# Altium project Beagle93.PrjPCB (part 4 of 5)

## Sheet dac.SchDoc
size A4
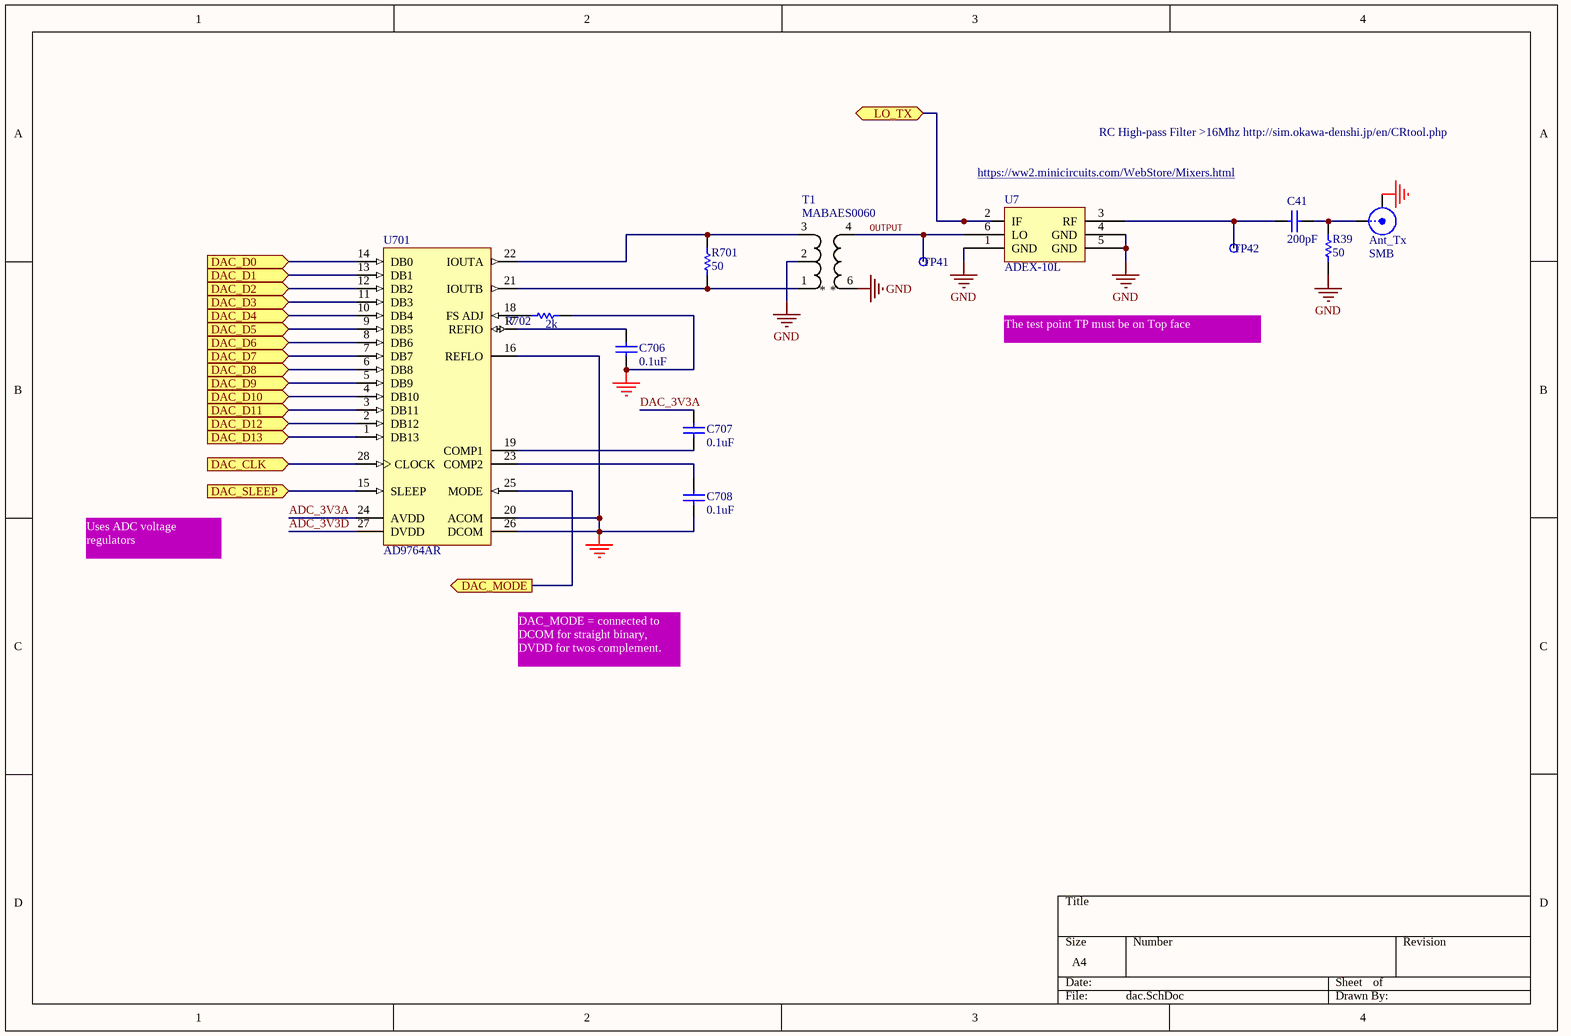
[diagram p6: dac.SchDoc]

### Parts
(Parts that share a designator on the sheet are numbered #1, #2 ... from top to bottom, then left to right.)
Ant_Tx  SMB  [SMB_V-RJ45]
C41  value 200pF  [0402]  (hidden comment: Cap Semi)
C706  0.1uF  [CAPC1005X55N]
C707  0.1uF  [CAPC1005X55N]
C708  0.1uF  [CAPC1005X55N]
R39  value 50  [0402]  (hidden comment: Res Semi)
R701  50  [RESC1005N]
R702  2k  [RESC1005N]
T1  MABAES0060  [MABAES0060]
TP41  LO_RX  [TPS127]  (value not drawn)
TP42#2  LO_RX  [TPS127]  (value not drawn)
U7  ADEX-10L
U701  AD9764AR  [TSSOP-28]

### Ports
DAC_CLK (in), DAC_D0 (in), DAC_D1 (in), DAC_D2 (in), DAC_D3 (in), DAC_D4 (in), DAC_D5 (in), DAC_D6 (in), DAC_D7 (in), DAC_D8 (in), DAC_D9 (in), DAC_D10 (in), DAC_D11 (in), DAC_D12 (in), DAC_D13 (in), DAC_MODE (out), DAC_SLEEP (in), LO_TX

### Nets
GND: Ant_Tx.2(Y) C706.1 C708.1 R39.1 R702.2 T1.2 T1.6 U7.1(GND) U7.4(GND) U7.5(GND) U701.16(REFLO) U701.20(ACOM) U701.26(DCOM)  [project net DXN_0]
ADC_3V3A: U701.24(AVDD)
ADC_3V3D: U701.27(DVDD)
DAC_3V3A: C707.1
DAC_CLK: U701.28(CLOCK) ; port DAC_CLK
DAC_D0: U701.14(DB0) ; port DAC_D0
DAC_D1: U701.13(DB1) ; port DAC_D1
DAC_D2: U701.12(DB2) ; port DAC_D2
DAC_D3: U701.11(DB3) ; port DAC_D3
DAC_D4: U701.10(DB4) ; port DAC_D4
DAC_D5: U701.9(DB5) ; port DAC_D5
DAC_D6: U701.8(DB6) ; port DAC_D6
DAC_D7: U701.7(DB7) ; port DAC_D7
DAC_D8: U701.6(DB8) ; port DAC_D8
DAC_D9: U701.5(DB9) ; port DAC_D9
DAC_D10: U701.4(DB10) ; port DAC_D10
DAC_D11: U701.3(DB11) ; port DAC_D11
DAC_D12: U701.2(DB12) ; port DAC_D12
DAC_D13: U701.1(DB13) ; port DAC_D13
DAC_SLEEP: U701.15(SLEEP) ; port DAC_SLEEP
OUTPUT: T1.4 TP41.1 U7.6(LO)
NetAnt_Tx_1: Ant_Tx.1(X) C41.2 R39.2
NetC41_1: C41.1 TP42#2.1 U7.3(RF)
NetC706_2: C706.2 U701.17(REFIO)
NetC707_2: C707.2 U701.19(COMP1)
NetC708_2: C708.2 U701.23(COMP2)
NetR701_1: R701.1 T1.3 U701.22(IOUTA)
NetR701_2: R701.2 T1.1 U701.21(IOUTB)
NetR702_1: R702.1 U701.18(FS_ADJ)
NetU7_2: U7.2(IF) ; port LO_TX
NetU701_25: U701.25(MODE) ; port DAC_MODE

### Notes on the sheet
- https://ww2.minicircuits.com/WebStore/Mixers.html
- RC High-pass Filter >16Mhz http://sim.okawa-denshi.jp/en/CRtool.php
- The test point TP must be on Top face
- Uses ADC voltage regulators
- DAC_MODE = connected to DCOM for straight binary, DVDD for twos complement.

### Library data of the parts
Ant_Tx = SMB: SMB Straight Connector; LatestRevisionDate: 17-Jul-2002; LatestRevisionNote: Re-released for DXP Platform.; Publisher: Altium Limited
C41 = Cap Semi: Capacitor (Semiconductor SIM Model); Published: 8-Jun-2000; LatestRevisionDate: 29-May-2009; LatestRevisionNote: IPC-7351 Footprint Added.; PackageReference: C1206; Publisher: Altium Limited; PackageDescription: Chip Capacitor
C706-C708 = Cap: as C1 on sheet adc; Published: 8-Jun-2000; Revision: July-2002: Re-released for DXP Platform.; Publisher: Altium Limited; Value: 0.1uF; Distributor: Digikey; Distributor Part Number: PCC1843CT-ND
R39 = Res Semi: Semiconductor Resistor; Published: 8-Jun-2000; LatestRevisionDate: 17-Jul-2002; LatestRevisionNote: Re-released for DXP Platform.; PackageReference: AXIAL-0.5; Publisher: Altium Limited; PackageDescription: Axial Device, Thru-Hole; 2 Leads; 0.5 in Pin Spacing
R701 = Res1: Resistor; Manufacturer: Generic Components; Class I: Passive; Value: 1K; Published: 8-Jun-2000; Revision: July-2002: Re-released for DXP Platform.; Publisher: Altium Limited; Class II: Resistor
R702 = Res1: Resistor; Manufacturer: Generic Components; Class I: Passive; Published: 8-Jun-2000; Revision: July-2002: Re-released for DXP Platform.; Publisher: Altium Limited; Class II: Resistor; Value: 2K
T1 = Balun: Manufacturer: Mini-Circuits; Part Description: RF balun 0.3-200Mhz; Manufacturer Part Number 1: MABAES0060; Supplier Part Number 1: 1465-1317-1-ND; Supplier 1: digikey
TP41 TP42#2 = SMD_PAD_1.27X1.27MM: as DFS on sheet adc; Part Number: SMD_PAD_1.27X1.27MM; Component Kind: Standard (No BOM); Component Type: Standard (No BOM); Pin Count: 1; Family: Test Point; Socket: No; SMD: Yes; Sense: No; Status: None; ComponentHeight: 0mm; HelpURL: Undefined; Author: CERN DEM JLC; CreateDate: 12.01.2008; LatestRevisionDate: 12.01.2008; PackageDescription: 1.27mm x 1.27mm PCB Copper Area (SMD Test Point)
U7 = ADEX-10L: Passive Mixer
U701 = AD9764AR: Single 14-Bit TxDAC, 125 Msps, -40 to +85 degC, RW-28, Tube; ADI Part Number: AD9764; Manufacturer: Analog Devices; # DAC Outputs: 1; Max V+: 5.5V; Op Pwr Diss: 170mW; Resolution (Bits): 14; Settling Time: 35ns; Single Supply: Yes; DatasheetVersion: Rev.B; PackageVersion: 060706-A; PackageReference: RW-28; PackageDescription: 28-Lead Standard Small Outline Package [SOIC_W]; Packing: Tube; RoHS: N; Mounting Technology: Surface Mount; Code_JEDEC: MS-013-AE; ComponentLink1Description: Manufacturer URL; ComponentLink1URL: http://www.analog.com/en/index.html; ComponentLink2Description: Datasheet; ComponentLink2URL: http://www.analog.com/static/imported-files/data_sheets/AD9764.pdf; ComponentLink3Description: URL Link1; ComponentLink3URL: Product URL:http://www.analog.com/en/digital-to-analog-converters/da-converters/ad9764/products/product.html

## Sheet avr.SchDoc
size A2
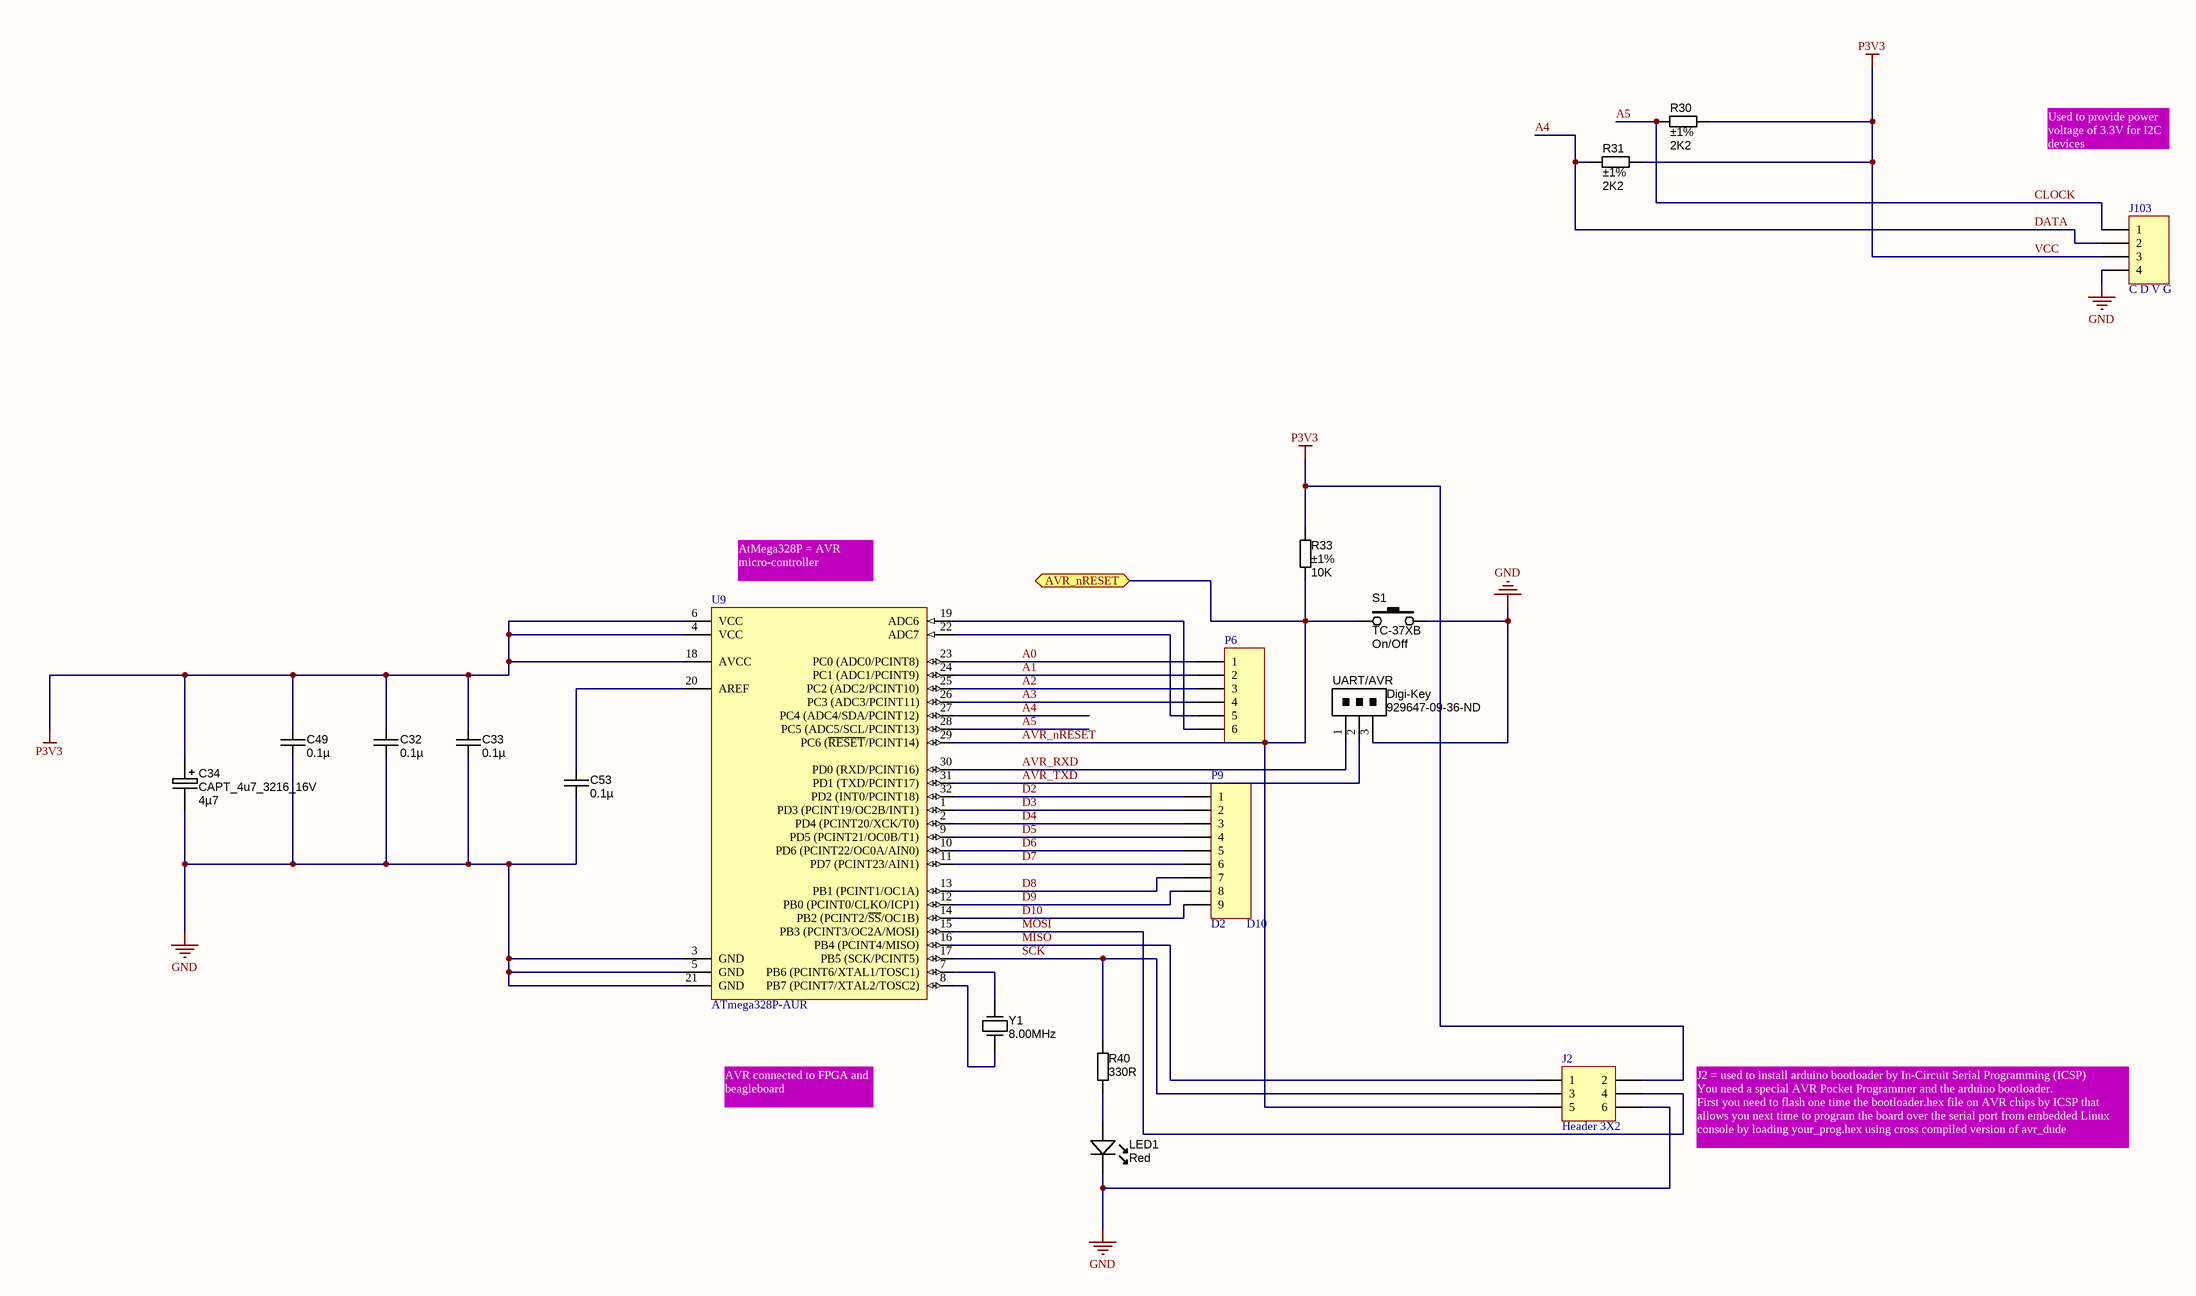
[diagram p7: avr.SchDoc]

### Parts
C32  0.1µ  [CAPC1005X55N]
C33  0.1µ  [CAPC1005X55N]
C34  CAPT_4u7_3216_16V  value 4µ7  [CAPMP3216X180N]
C49  0.1µ  [CAPC1005X55N]
C53  0.1µ  [CAPC1005X55N]
J2  Header 3X2  [HDR2X3]
J103  C D V G  [HDR1X4]
LED1  Color: Red  [LED-0603-RED]
P6  (no value)  [HDR1X6]
P9  D2       D10  [HDR1X9]
R30  value 2K2  Tolerance: ±1%  [RESC1005N]  (hidden comment: Thick Film)
R31  value 2K2  Tolerance: ±1%  [RESC1005N]  (hidden comment: Thick Film)
R33  value 10K  Tolerance: ±1%  [RESC1005X40N]  (hidden comment: Thick Film)
R40  value 330R  [RESC1005X40N]  (hidden comment: Thick Film)
S1  Manufacturer Part Number 1: TC-37XB  Function: On/Off  [TACT-SWITCH-TS1143]  (hidden comment: SW_THT_PB_5.0mm)
U9  ATmega328P-AUR  [32A_N]
UART/AVR  Supplier 1: Digi-Key  Supplier Part Number 1: 929647-09-36-ND  [1x3POS_HEADER]  (hidden comment: R T G)
Y1  8.00MHz  [CRYSTAL_HC49-US-SM]

### Ports
AVR_nRESET (bidir)

### Nets
GND: C32.2 C33.2 C34.2 C49.2 C53.2 J2.6 J103.4 LED1.K S1.2 U9.3(GND) U9.5(GND) U9.21(GND) UART/AVR.3  [project net DXN_0]
VCC: C32.1 C33.1 C34.1 C49.1 J2.2 J103.3 R30.2 R31.2 R33.1 U9.4(VCC) U9.6(VCC) U9.18(AVCC)  [also labelled P3V3]
A0: P6.1 U9.23(PC0_(ADC0/PCINT8))
A1: P6.2 U9.24(PC1_(ADC1/PCINT9))
A2: P6.3 U9.25(PC2_(ADC2/PCINT10))
A3: P6.4 U9.26(PC3_(ADC3/PCINT11))
A4: J103.2 R31.1 U9.27(PC4_(ADC4/SDA/PCINT12))  [also labelled DATA]
A5: J103.1 R30.1 U9.28(PC5_(ADC5/SCL/PCINT13))  [also labelled CLOCK]
AVR_nRESET: J2.5 R33.2 S1.1 U9.29(PC6_(~{RESET}/PCINT14)) ; port AVR_nRESET
AVR_RXD: U9.30(PD0_(RXD/PCINT16)) UART/AVR.1
AVR_TXD: U9.31(PD1_(TXD/PCINT17)) UART/AVR.2
D2: P9.1 U9.32(PD2_(INT0/PCINT18))
D3: P9.2 U9.1(PD3_(PCINT19/OC2B/INT1))
D4: P9.3 U9.2(PD4_(PCINT20/XCK/T0))
D5: P9.4 U9.9(PD5_(PCINT21/OC0B/T1))
D6: P9.5 U9.10(PD6_(PCINT22/OC0A/AIN0))
D7: P9.6 U9.11(PD7_(PCINT23/AIN1))
D8: P9.7 U9.13(PB1_(PCINT1/OC1A))
D9: P9.8 U9.12(PB0_(PCINT0/CLKO/ICP1))
D10: P9.9 U9.14(PB2_(PCINT2/~{SS}/OC1B))
MISO: J2.1 U9.16(PB4_(PCINT4/MISO))
MOSI: J2.4 U9.15(PB3_(PCINT3/OC2A/MOSI))
SCK: J2.3 R40.1 U9.17(PB5_(SCK/PCINT5))
NetC53_1: C53.1 U9.20(AREF)
NetLED1_A: LED1.A R40.2
NetP6_5: P6.5 U9.22(ADC7)
NetP6_6: P6.6 U9.19(ADC6)
NetU9_7: U9.7(PB6_(PCINT6/XTAL1/TOSC1)) Y1.2(OUT)
NetU9_8: U9.8(PB7_(PCINT7/XTAL2/TOSC2)) Y1.1(IN)

### Notes on the sheet
- Used to provide power voltage of 3.3V for I2C devices
- (near U9) AtMega328P = AVR micro-controller
- AVR connected to FPGA and beagleboard
- J2 = used to install arduino bootloader by In-Circuit Serial Programming (ICSP)
  You need a special AVR Pocket Programmer and the arduino bootloader.
  First you need to flash one time the bootloader.hex file on AVR chips by ICSP that
  allows you next time to program the board over the serial port from embedded Linux
  console by loading your_prog.hex using cross compiled version of avr_dude

### Library data of the parts
C32 C33 C49 C53 = CAPC_1u_0402_X5R_6V3_10%: Capacitor SMD Cer 1uF 10% 16V X5R 0402; Manufacturer 1: AVX Corporation; Manufacturer Part Number 1: 04026D105KAT2A; Ratings: 6.3V; X5R; SCDType: spec; Value: 0.1µ; Tolerance: ±10%; Operating Temperature: -55°C ~ 125°C; Package / Case: 0402 (1005 Metric); Size / Dimension: 0.039" L x 0.020" W (1.00mm x 0.50mm); Supplier 1: Digi-Key; Supplier Part Number 1: 478-2583-1-ND; RoHS 1: RoHS Compliant; ComponentLink1URL: http://www.avx.com/docs/Catalogs/cx5r.pdf; ComponentLink1Description: http://www.avx.com/docs/Catalogs/cx5r.pdf; Supplier 2: Digi-Key; Supplier Part Number 2: 311-1438-1-ND; Manufacturer 2: Yageo; Manufacturer Part Number 2: CC0402KRX5R5BB105; RoHS 2: RoHS Compliant; ComponentLink2URL: http://www.yageo.com/documents/recent/UPY-GPHC_X5R_4V-to-50V_12.pdf; ComponentLink2Description: http://www.yageo.com/documents/recent/UPY-GPHC_X5R_4V-to-50V_12.pdf; Supplier 3: Digi-Key; Supplier Part Number 3: 1276-1010-1-ND; Manufacturer 3: Samsung Electro-Mechanics America, Inc; Manufacturer Part Number 3: CL05A105KQ5NNNC; RoHS 3: RoHS Compliant; ComponentLink3URL: http://www.samsungsem.com/servlet/FileDownload?path=productsearch&sname=CL05A105KQ5NNNC.pdf&oname=CL05A105KQ5NNNC.pdf; ComponentLink3Description: http://www.samsungsem.com/servlet/FileDownload?path=productsearch&sname=CL05A105KQ5NNNC.pdf&oname=CL05A105KQ5NNNC.pdf; Supplier 4: Digi-Key; Supplier Part Number 4: 445-4998-1-ND; Manufacturer 4: TDK Corporation; Manufacturer Part Number 4: C1005X5R0J105K050BB; RoHS 4: RoHS Compliant; ComponentLink4URL: http://product.tdk.com/capacitor/mlcc/en/documents/mlcc_commercial_general_en.pdf; ComponentLink4Description: http://product.tdk.com/capacitor/mlcc/en/documents/mlcc_commercial_general_en.pdf; Supplier 5: Digi-Key; Supplier Part Number 5: 490-1320-1-ND; Manufacturer 5: Murata Electronics North America; Manufacturer Part Number 5: GRM155R60J105KE19D; RoHS 5: RoHS Compliant; ComponentLink5URL: http://www.murata.com/products/catalog/pdf/c02e.pdf; ComponentLink5Description: http://www.murata.com/products/catalog/pdf/c02e.pdf
C34 = CAPT_4u7_3216_16V: Capacitor SMD Tantalum 4.7uF 10% 16V 3216-18; Manufacturer 1: Vishay/Sprague; Manufacturer Part Number 1: 293D475X9016A2TE3; SCDType: undef; Package / Case: EIA 535BAAC size A; Ratings: 16V; Tolerance: ±10%; Material: Tantalum; Supplier 1: Digi-Key; Supplier Part Number 1: 718-1148-1-ND
J2 = Header 3X2: Header, 3-Pin, Dual row; LatestRevisionDate: 17-Jul-2002; LatestRevisionNote: Re-released for DXP Platform.; Publisher: Altium Limited
J103 = Header 4: Header, 4-Pin; LatestRevisionDate: 17-Jul-2002; LatestRevisionNote: Re-released for DXP Platform.; Publisher: Altium Limited
LED1 = LED_SMD_Red_0805_6mcd: LED 0805 SMD Red 6mcd 621nm; Manufacturer 1: Lite-On Inc; Manufacturer Part Number 1: LTST-C171EKT; Material: GaAsP on GaP; Ratings: 6 mcd; 621 nm; SCDType: source; Package / Case: 0805; Supplier 1: Digi-Key; Supplier Part Number 1: 160-1422-1-ND; Value: Red
P6 = Header 6: Header, 6-Pin; LatestRevisionDate: 17-Jul-2002; LatestRevisionNote: Re-released for DXP Platform.; Publisher: Altium Limited
P9 = Header 9: Header, 9-Pin; LatestRevisionDate: 17-Jul-2002; LatestRevisionNote: Re-released for DXP Platform.; Publisher: Altium Limited
R30 R31 = RES_2K2_0805_1%: Resistor SMD chip 2.2k Ohm 0.125W 1% 0805; Manufacturer 1: Vishay/Dale; Manufacturer Part Number 1: CRCW08052K20FKEA; Ratings: 1/8W; SCDType: spec; Supplier 1: Digi-Key; Supplier Part Number 1: 541-2.20KCCT-ND; Package / Case: 0805 (2012 metric)
R33 = RES_10K_0402_1%: Resistor SMD chip 10k Ohm 0.063W 1% 0402; Manufacturer 1: Vishay Dale; Manufacturer Part Number 1: CRCW040210K0FKED; Ratings: 1/16 W; SCDType: spec; Package / Case: 0402 (1005 Metric); Manufacturer 2: Yageo; Manufacturer Part Number 2: RC0402FR-0710KL; Supplier 1: Digi-Key; Supplier Part Number 1: 541-10.0KLCT-ND; ComponentLink1URL: http://www.vishay.com/doc?20035; ComponentLink1Description: http://www.vishay.com/doc?20035; Supplier 2: Digi-Key; Supplier Part Number 2: 311-10.0KLRCT-ND; ComponentLink2URL: http://www.yageo.com/documents/recent/PYu-RC0402_51_RoHS_L_6.pdf; ComponentLink2Description: http://www.yageo.com/documents/recent/PYu-RC0402_51_RoHS_L_6.pdf
R40 = RES_330R_0402_5%: Resistor SMD chip 330 Ohm 0.063W 5% 0402; Manufacturer 1: Yageo; Manufacturer Part Number 1: RC0402JR-07330RL; Ratings: 1/16 W; SCDType: spec; Package / Case: 0402 (1005 Metric); Tolerance: ±5%; Supplier 1: Digi-Key; Supplier Part Number 1: 311-330JRCT-ND; ComponentLink1URL: http://www.yageo.com/documents/recent/PYu-RC0402_51_RoHS_L_6.pdf; ComponentLink1Description: http://www.yageo.com/documents/recent/PYu-RC0402_51_RoHS_L_6.pdf
S1 = SW_THT_PB_5.0mm: Switch, tact, 5.0mm stem; Manufacturer 1: Wealth Metal; SCDType: spec; Package / Case: 6.5x6.5mm; 5.0mm stem; Material: Brass/Nylon/Ag plating
U9 = ATmega328-AUR: 8-bit AVR Microcontroller, 32KB Flash, 1KB EEPROM, 2KB SRAM, 32-pin TQFP, Industrial Grade (-40°C to 85°C); Published: 1-Apr-2010; DatasheetVersion: revA, Jan-2010; PackageVersion: revB, Oct-2001; PackageReference: 32A; Publisher: Altium Limited; PackageDescription: 32-Lead, 7x7x1.0 mm Body, 0.8mm Lead Pitch, Thin Profile Plastic Quad Flat Package (TQFP); Supplier 1: Digi-Key; Supplier Part Number 1: ATMEGA328P-AUR-ND; Supplier 2: Mouser; Supplier Part Number 2: 556-ATMEGA328P-AUR; Code_JEDEC: MS-026-ABA; ComponentLink1Description: Manufacturer Link; ComponentLink1URL: http://www.atmel.com/products/avr/default.asp?; ComponentLink2Description: ATmega48A/48PA/88A/88PA/168A/168PA/328/328P Datasheet; ComponentLink2URL: http://www.atmel.com/dyn/resources/prod_documents/8271.pdf; ComponentLink3Description: ATmega48A/48PA/88A/88PA/168A/168PA/328/328P Summary; ComponentLink3URL: http://www.atmel.com/dyn/resources/prod_documents/8271S.pdf; ComponentLink4Description: Atmel.com Home; ComponentLink4URL: http://www.atmel.com
UART/AVR = CONN_HEADER_1x3P_0.100in: Pin Header, THT, Single-row, 2.54mm pitch; Manufacturer 1: 3M; Manufacturer Part Number 1: 929647-09-36-I; Pitch: 0.100" (2.54mm); Value: Single-row, 3 positions; QtyOverride: 0.1; SCDType: undef; Category: Connectors; Mounting Type: Through Hole; Terminal Block Type: Header, Male Pins, Single; Package / Case: Pin header; 2.54mm pitch
Y1 = Crystal_6MHz_HC49/US: Resonator Ceramic 8.00 MHz 30ppm; Manufacturer 1: CTS-Frequency Controls; Manufacturer Part Number 1: ATS080BSM-1; Frequency: 8MHz; Frequency Stability: ±50ppm; Load Capacitance: 18pF; Operating Mode: Fundamental; Parameter Name: 0.169" (4.30mm); Package / Case: HC49/US-SM; Ratings: 8.00 MHz; Supplier 1: Digi-Key; Type: 8 MHz Crystal; Frequency Tolerance: ±30ppm; Operating Temperature: -20°C ~ 70°C; Mounting Type: Surface Mount; Size / Dimension: 0.437" L x 0.190" W (11.10mm x 4.83mm); ComponentLink1URL: http://www.ctscorp.com/components/Datasheets/008-0309-0.pdf; ComponentLink1Description: http://www.ctscorp.com/components/Datasheets/008-0309-0.pdf

## Sheet main.schdoc
size A2; Organization: Protel International P/L; Address1: L3, 12a Rodborough Rd; Address2: Frenchs Forest; Address3: NSW; Address4: Australia 2086
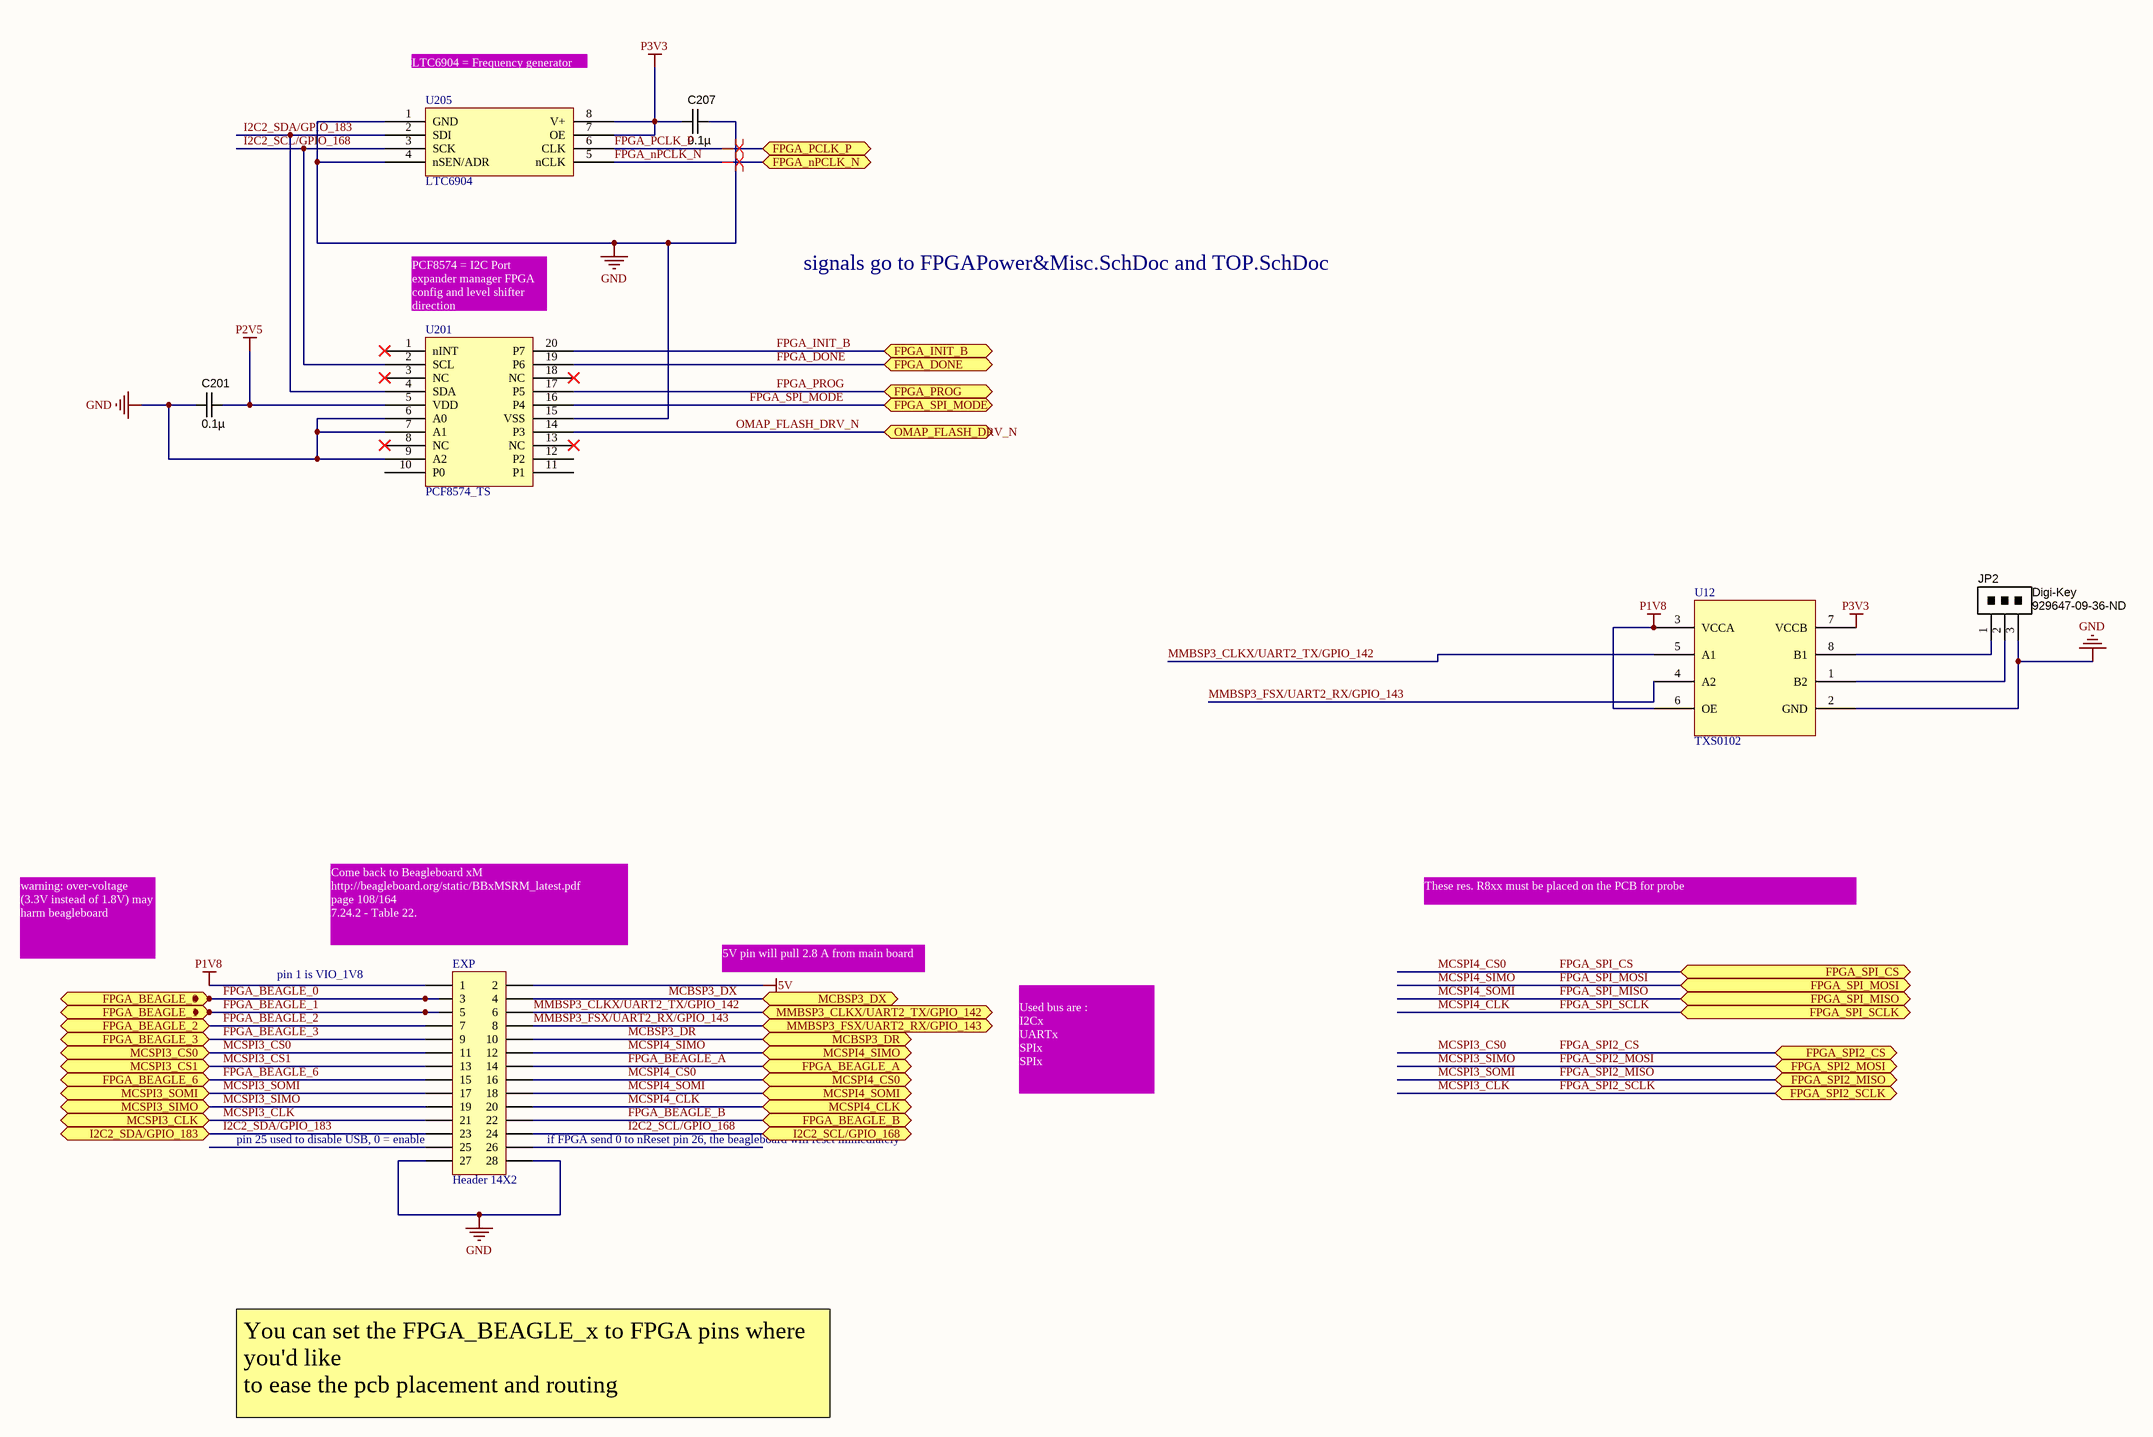
[diagram p8: main.schdoc]

### Parts
C201  0.1µ  [CAPC1005X55N]
C207  0.1µ  [CAPC1005X55N]
EXP  Header 14X2  [HDR2X14]
JP2  Supplier 1: Digi-Key  Supplier Part Number 1: 929647-09-36-ND  [1x3POS_HEADER]  (hidden comment: R T G)
U12  TXS0102  [TSSOP65P400X110-8N]
U201  PCF8574_TS  [TSSOP65P640X120-20N]
U205  LTC6904  [SOP65P490X109-8N]

### Ports
FPGA_BEAGLE_0 (bidir), FPGA_BEAGLE_1 (bidir), FPGA_BEAGLE_2 (bidir), FPGA_BEAGLE_3 (bidir), FPGA_BEAGLE_6 (bidir), FPGA_BEAGLE_A (bidir), FPGA_BEAGLE_B (bidir), FPGA_DONE (bidir), FPGA_INIT_B (bidir), FPGA_nPCLK_N (bidir), FPGA_PCLK_P (bidir), FPGA_PROG (bidir), FPGA_SPI2_CS (bidir), FPGA_SPI2_MISO (bidir), FPGA_SPI2_MOSI (bidir), FPGA_SPI2_SCLK (bidir), FPGA_SPI_CS (bidir), FPGA_SPI_MISO (bidir), FPGA_SPI_MODE (bidir), FPGA_SPI_MOSI (bidir), FPGA_SPI_SCLK (bidir), I2C2_SCL/GPIO_168 (bidir), I2C2_SDA/GPIO_183 (bidir), MCBSP3_DR (bidir), MCBSP3_DX (bidir), MCSPI3_CLK (bidir), MCSPI3_CS0 (bidir), MCSPI3_CS1 (bidir), MCSPI3_SIMO (bidir), MCSPI3_SOMI (bidir), MCSPI4_CLK (bidir), MCSPI4_CS0 (bidir), MCSPI4_SIMO (bidir), MCSPI4_SOMI (bidir), MMBSP3_CLKX/UART2_TX/GPIO_142 (bidir), MMBSP3_FSX/UART2_RX/GPIO_143 (bidir), OMAP_FLASH_DRV_N (bidir)

### Nets
5V: EXP.2
GND: C201.2 C207.1 EXP.27 EXP.28 JP2.3 U12.2(GND) U201.6(A0) U201.7(A1) U201.9(A2) U201.15(VSS) U205.1(GND) U205.4(nSEN/ADR)  [project net DXN_0]
P1V8: EXP.1 U12.3(VCCA) U12.6(OE)
P2V5: C201.1 U201.5(VDD)
P3V3: C207.2 U12.7(VCCB) U205.7(OE) U205.8(V+)  [project net VCC]
FPGA_BEAGLE_0: EXP.3 ; port FPGA_BEAGLE_0
FPGA_BEAGLE_1: EXP.5 ; port FPGA_BEAGLE_1
FPGA_BEAGLE_2: EXP.7 ; port FPGA_BEAGLE_2
FPGA_BEAGLE_3: EXP.9 ; port FPGA_BEAGLE_3
FPGA_BEAGLE_6: EXP.15 ; port FPGA_BEAGLE_6
FPGA_BEAGLE_A: EXP.14 ; port FPGA_BEAGLE_A
FPGA_BEAGLE_B: EXP.22 ; port FPGA_BEAGLE_B
FPGA_DONE: U201.19(P6) ; port FPGA_DONE
FPGA_INIT_B: U201.20(P7) ; port FPGA_INIT_B
FPGA_nPCLK_N: U205.5(nCLK) ; port FPGA_nPCLK_N
FPGA_PCLK_P: U205.6(CLK) ; port FPGA_PCLK_P
FPGA_PROG: U201.17(P5) ; port FPGA_PROG
FPGA_SPI2_CS: EXP.11 ; port MCSPI3_CS0, port FPGA_SPI2_CS  [also labelled MCSPI3_CS0]
FPGA_SPI2_MISO: EXP.17 ; port MCSPI3_SOMI, port FPGA_SPI2_MISO  [also labelled MCSPI3_SOMI]
FPGA_SPI2_MOSI: EXP.19 ; port MCSPI3_SIMO, port FPGA_SPI2_MOSI  [also labelled MCSPI3_SIMO]
FPGA_SPI2_SCLK: EXP.21 ; port MCSPI3_CLK, port FPGA_SPI2_SCLK  [also labelled MCSPI3_CLK]
FPGA_SPI_CS: EXP.16 ; port MCSPI4_CS0, port FPGA_SPI_CS  [also labelled MCSPI4_CS0]
FPGA_SPI_MISO: EXP.18 ; port MCSPI4_SOMI, port FPGA_SPI_MISO  [also labelled MCSPI4_SOMI]
FPGA_SPI_MODE: U201.16(P4) ; port FPGA_SPI_MODE
FPGA_SPI_MOSI: EXP.12 ; port MCSPI4_SIMO, port FPGA_SPI_MOSI  [also labelled MCSPI4_SIMO]
FPGA_SPI_SCLK: EXP.20 ; port MCSPI4_CLK, port FPGA_SPI_SCLK  [also labelled MCSPI4_CLK]
I2C2_SCL/GPIO_168: EXP.24 U201.2(SCL) U205.3(SCK) ; port I2C2_SCL/GPIO_168
I2C2_SDA/GPIO_183: EXP.23 U201.4(SDA) U205.2(SDI) ; port I2C2_SDA/GPIO_183
MCBSP3_DR: EXP.10 ; port MCBSP3_DR
MCBSP3_DX: EXP.4 ; port MCBSP3_DX
MCSPI3_CS1: EXP.13 ; port MCSPI3_CS1
MMBSP3_CLKX/UART2_TX/GPIO_142: EXP.6 U12.5(A1) ; port MMBSP3_CLKX/UART2_TX/GPIO_142
MMBSP3_FSX/UART2_RX/GPIO_143: EXP.8 U12.4(A2) ; port MMBSP3_FSX/UART2_RX/GPIO_143
OMAP_FLASH_DRV_N: U201.14(P3) ; port OMAP_FLASH_DRV_N
NetJP2_1: JP2.1 U12.8(B1)
NetJP2_2: JP2.2 U12.1(B2)

Not connected (* = marked no-connect by the designer): EXP 25 26; U201 1(nINT)* 3(NC)* 8(NC)* 10(P0) 11(P1) 12(P2) 13(NC)* 18(NC)*

### Layout directives
differential pair: FPGA_nPCLK_N, FPGA_PCLK_P

### Notes on the sheet
- LTC6904 = Frequency generator
- (near U201) PCF8574 = I2C Port expander manager FPGA config and level shifter direction
- signals go to FPGAPower&Misc.SchDoc and TOP.SchDoc
- These res. R8xx must be placed on the PCB for probe
- warning: over-voltage (3.3V instead of 1.8V) may harm beagleboard
- pin 1 is VIO_1V8
- (near EXP) Come back to Beagleboard xM
  http://beagleboard.org/static/BBxMSRM_latest.pdf
  page 108/164
  7.24.2 - Table 22.
- 5V pin will pull 2.8 A from main board
- Used bus are :
  I2Cx
  UARTx
  SPIx
  SPIx
- (near EXP) pin 25 used to disable USB, 0 = enable
- (near EXP) if FPGA send 0 to nReset pin 26, the beagleboard will reset immediately
- You can set the FPGA_BEAGLE_x to FPGA pins where you'd like
  to ease the pcb placement and routing
- Title
- Size:
- Date:
- File:
- A1
- Number:
- Time:
- Revision:
- Sheet
- of

### Library data of the parts
C201 C207 = CAPC_1u_0402_X5R_6V3_10%: as C32 on sheet avr; Tolerance: ±10%; Operating Temperature: -55°C ~ 125°C; Package / Case: 0402 (1005 Metric); Size / Dimension: 0.039" L x 0.020" W (1.00mm x 0.50mm); Supplier 1: Digi-Key; Supplier Part Number 1: 478-2583-1-ND; RoHS 1: RoHS Compliant; ComponentLink1URL: http://www.avx.com/docs/Catalogs/cx5r.pdf; ComponentLink1Description: http://www.avx.com/docs/Catalogs/cx5r.pdf; Supplier 2: Digi-Key; Supplier Part Number 2: 311-1438-1-ND; Manufacturer 2: Yageo; Manufacturer Part Number 2: CC0402KRX5R5BB105; RoHS 2: RoHS Compliant; ComponentLink2URL: http://www.yageo.com/documents/recent/UPY-GPHC_X5R_4V-to-50V_12.pdf; ComponentLink2Description: http://www.yageo.com/documents/recent/UPY-GPHC_X5R_4V-to-50V_12.pdf; Supplier 3: Digi-Key; Supplier Part Number 3: 1276-1010-1-ND; Manufacturer 3: Samsung Electro-Mechanics America, Inc; Manufacturer Part Number 3: CL05A105KQ5NNNC; RoHS 3: RoHS Compliant; ComponentLink3URL: http://www.samsungsem.com/servlet/FileDownload?path=productsearch&sname=CL05A105KQ5NNNC.pdf&oname=CL05A105KQ5NNNC.pdf; ComponentLink3Description: http://www.samsungsem.com/servlet/FileDownload?path=productsearch&sname=CL05A105KQ5NNNC.pdf&oname=CL05A105KQ5NNNC.pdf; Supplier 4: Digi-Key; Supplier Part Number 4: 445-4998-1-ND; Manufacturer 4: TDK Corporation; Manufacturer Part Number 4: C1005X5R0J105K050BB; RoHS 4: RoHS Compliant; ComponentLink4URL: http://product.tdk.com/capacitor/mlcc/en/documents/mlcc_commercial_general_en.pdf; ComponentLink4Description: http://product.tdk.com/capacitor/mlcc/en/documents/mlcc_commercial_general_en.pdf; Supplier 5: Digi-Key; Supplier Part Number 5: 490-1320-1-ND; Manufacturer 5: Murata Electronics North America; Manufacturer Part Number 5: GRM155R60J105KE19D; RoHS 5: RoHS Compliant; ComponentLink5URL: http://www.murata.com/products/catalog/pdf/c02e.pdf; ComponentLink5Description: http://www.murata.com/products/catalog/pdf/c02e.pdf; Value: 0.1µ
EXP = Header 14X2: Header, 14-Pin, Dual row; LatestRevisionDate: 17-Jul-2002; LatestRevisionNote: Re-released for DXP Platform.; Publisher: Altium Limited
JP2 = CONN_HEADER_1x3P_0.100in: as UART/AVR on sheet avr; Category: Connectors; Mounting Type: Through Hole; Terminal Block Type: Header, Male Pins, Single; Package / Case: Pin header; 2.54mm pitch

## Sheet ethernet.SchDoc: Ethernet Section
size B; DrawnBy: Adam Vadala-Roth; DocumentNumber: 5; Revision: 2.4b; SheetNumber: 5; SheetTotal: 9
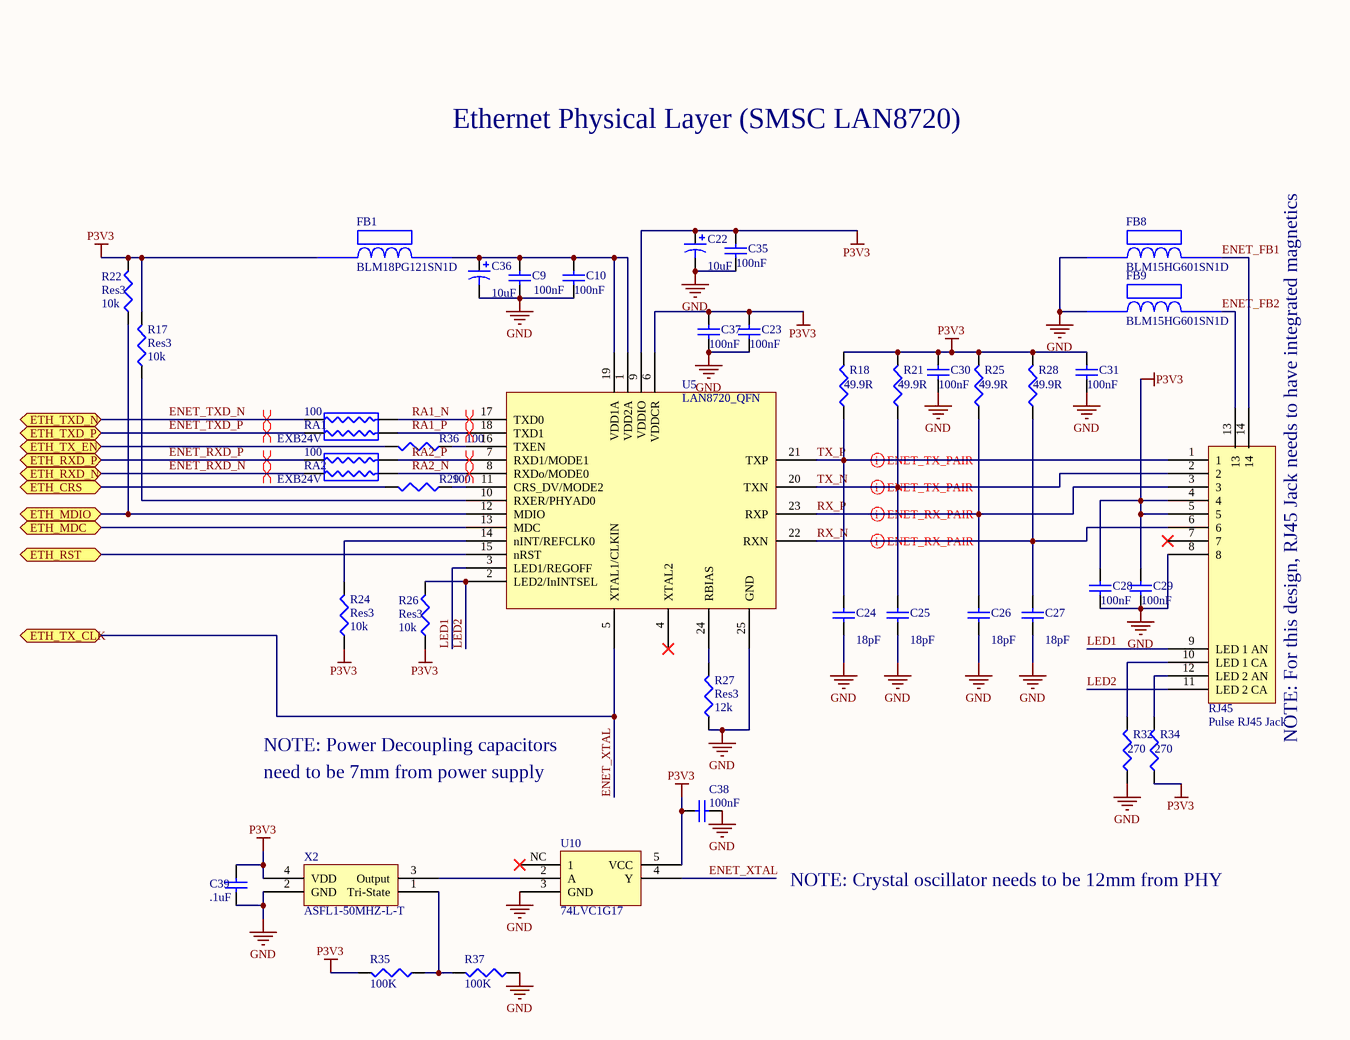
[diagram p9: ethernet.SchDoc]

### Parts
C9  value 100nF  [1608[0603]]  (hidden comment: Cap Semi)
C10  value 100nF  [1608[0603]]  (hidden comment: Cap Semi)
C22  value 10uF  [CAPC1005X55N]  (hidden comment: Cap Pol3)
C23  value 100nF  [1608[0603]]  (hidden comment: Cap Semi)
C24  value 18pF  [1608[0603]]  (hidden comment: Cap Semi)
C25  value 18pF  [1608[0603]]  (hidden comment: Cap Semi)
C26  value 18pF  [1608[0603]]  (hidden comment: Cap Semi)
C27  value 18pF  [1608[0603]]  (hidden comment: Cap Semi)
C28  value 100nF  [1608[0603]]  (hidden comment: Cap Semi)
C29  value 100nF  [1608[0603]]  (hidden comment: Cap Semi)
C30  value 100nF  [1608[0603]]  (hidden comment: Cap Semi)
C31  value 100nF  [1608[0603]]  (hidden comment: Cap Semi)
C35  value 100nF  [1608[0603]]  (hidden comment: Cap Semi)
C36  value 10uF  [1608[0603]]  (hidden comment: Cap Pol3)
C37  value 100nF  [1608[0603]]  (hidden comment: Cap Semi)
C38  value 100nF  [1608[0603]]  (hidden comment: Cap Semi)
C39  value .1uF  [1608[0603]]  (hidden comment: Cap Semi)
FB1  BLM18PG121SN1D  [BLM18PG121SN1D]
FB8  BLM15HG601SN1D  [BLM18PG121SN1D]
FB9  BLM15HG601SN1D  [BLM18PG121SN1D]
R17  Res3  value 10k  [J1-0603]
R18  value 49.9R  [J1-0603]  (hidden comment: Res3)
R21  value 49.9R  [J1-0603]  (hidden comment: Res3)
R22  Res3  value 10k  [J1-0603]
R24  Res3  value 10k  [J1-0603]
R25  value 49.9R  [J1-0603]  (hidden comment: Res3)
R26  Res3  value 10k  [J1-0603]
R27  Res3  value 12k  [J1-0603]
R28  value 49.9R  [J1-0603]  (hidden comment: Res3)
R29  value 100  [J1-0603]  (hidden comment: Res3)
R32  value 270  [J1-0603]  (hidden comment: Res3)
R34  value 270  [J1-0603]  (hidden comment: Res3)
R35  value 100K  [J1-0603]  (hidden comment: Res3)
R36  value 100  [J1-0603]  (hidden comment: Res3)
R37  value 100K  [J1-0603]  (hidden comment: Res3)
RA1  EXB24V  value 100  [EXB24V - Res Array x2]
RA2  EXB24V  value 100  [EXB24V - Res Array x2]
RJ45  Pulse RJ45 Jack  [J0006D21BNL]
U5  LAN8720_QFN  [LAN8720_QFN]
U10  74LVC1G17  [74LVC1G17]
X2  ASFL1-50MHZ-L-T  [ASFL1-50MHZ-L-T]

### Ports
ETH_CRS, ETH_MDC, ETH_MDIO, ETH_RST, ETH_RXD_N, ETH_RXD_P, ETH_TX_CLK, ETH_TX_EN, ETH_TXD_N, ETH_TXD_P

### Nets
GND: C9.1 C10.1 C22.2 C23.1 C24.1 C25.1 C26.1 C27.1 C28.1 C29.1 C30.1 C31.1 C35.1 C36.2 C37.1 C38.1 C39.1 FB8.1 FB9.1 R27.1 R32.1 R37.1 RJ45.8 U5.25(GND) U10.3(GND) X2.2(GND)  [project net DXN_0]
P3V3: C22.1 C23.2 C28.2 C29.2 C30.2 C31.2 C35.2 C37.2 C38.2 C39.2 FB1.1 R17.2 R18.2 R21.2 R22.2 R24.1 R25.2 R26.1 R28.2 R34.1 R35.2 RJ45.4 RJ45.5 U5.6(VDDCR) U5.9(VDDIO) U10.5(VCC) X2.4(VDD)  [project net VCC]
ENET_FB1: FB8.2 RJ45.14
ENET_FB2: FB9.2 RJ45.13
ENET_RXD_N: RA2.1 ; port ETH_RXD_N
ENET_RXD_P: RA2.3 ; port ETH_RXD_P
ENET_TXD_N: RA1.3 ; port ETH_TXD_N
ENET_TXD_P: RA1.1 ; port ETH_TXD_P
ENET_XTAL: U5.5(XTAL1/CLKIN) U10.4(Y) ; port ETH_TX_CLK
ETH_CRS: R29.2 ; port ETH_CRS
ETH_MDC: U5.13(MDC) ; port ETH_MDC
ETH_MDIO: R22.1 U5.12(MDIO) ; port ETH_MDIO
ETH_RST: U5.15(nRST) ; port ETH_RST
ETH_TX_EN: R36.2 ; port ETH_TX_EN
LED1: RJ45.9(LED_1_AN) U5.3(LED1/REGOFF)
LED2: R26.2 RJ45.11(LED_2_CA) U5.2(LED2/InINTSEL)
RA1_N: RA1.4 U5.17(TXD0)
RA1_P: RA1.2 U5.18(TXD1)
RA2_N: RA2.2 U5.8(RXDo/MODE0)
RA2_P: RA2.4 U5.7(RXD1/MODE1)
RX_N: C27.2 R28.1 RJ45.6 U5.22(RXN)
RX_P: C26.2 R25.1 RJ45.3 U5.23(RXP)
TX_N: C25.2 R21.1 RJ45.2 U5.20(TXN)
TX_P: C24.2 R18.1 RJ45.1 U5.21(TXP)
NetC9_2: C9.2 C10.2 C36.1 FB1.2 U5.1(VDD2A) U5.19(VDD1A)
NetR17_1: R17.1 U5.10(RXER/PHYAD0)
NetR24_2: R24.2 U5.14(nINT/REFCLK0)
NetR27_2: R27.2 U5.24(RBIAS)
NetR29_1: R29.1 U5.11(CRS_DV/MODE2)
NetR32_2: R32.2 RJ45.10(LED_1_CA)
NetR34_2: R34.2 RJ45.12(LED_2_AN)
NetR35_1: R35.1 R37.2 X2.1(Tri-State)
NetR36_1: R36.1 U5.16(TXEN)
NetU10_2: U10.2(A) X2.3(Output)

Not connected (* = marked no-connect by the designer): RJ45 7*; U5 4(XTAL2)*; U10 NC(1)*

### Layout directives
differential pair: ENET_RXD_N, ENET_RXD_P, ENET_TXD_N, ENET_TXD_P, RA1_N, RA1_P, RA2_N, RA2_P, RX_N, RX_P, TX_N, TX_P

### Notes on the sheet
- Ethernet Physical Layer (SMSC LAN8720)
- (near RJ45) NOTE: For this design, RJ45 Jack needs to have integrated magnetics
- NOTE: Power Decoupling capacitors
- need to be 7mm from power supply
- NOTE: Crystal oscillator needs to be 12mm from PHY

### Library data of the parts
C9 C10 C23-C31 C35 C37-C39 = Cap Semi: Capacitor (Semiconductor SIM Model); Published: 8-Jun-2000; LatestRevisionDate: 29-May-2009; LatestRevisionNote: IPC-7351 Footprint Added.; PackageReference: C1206; Publisher: Altium Limited; PackageDescription: Chip Capacitor
C22 C36 = Cap Pol3: Polarized Capacitor (Surface Mount); Published: 8-Jun-2000; LatestRevisionDate: 29-May-2009; LatestRevisionNote: IPC-7351 Footprint Added.; PackageReference: C0805; Publisher: Altium Limited; PackageDescription: Chip Capacitor
R17 R18 R21 R22 R24-R29 R32 R34-R37 = Res3: Resistor; Published: 8-Jun-2000; LatestRevisionDate: 29-May-2009; LatestRevisionNote: IPC-7351 Footprint Added.; PackageReference: J1-0603; Publisher: Altium Limited; PackageDescription: Chip Resistor
RA1 RA2 = EXB24V - Res Array x2
RJ45 = Pulse RJ45_ICM_LED_Jack
U5 = LAN8720 QFN

## Sheet LO.SchDoc
size A
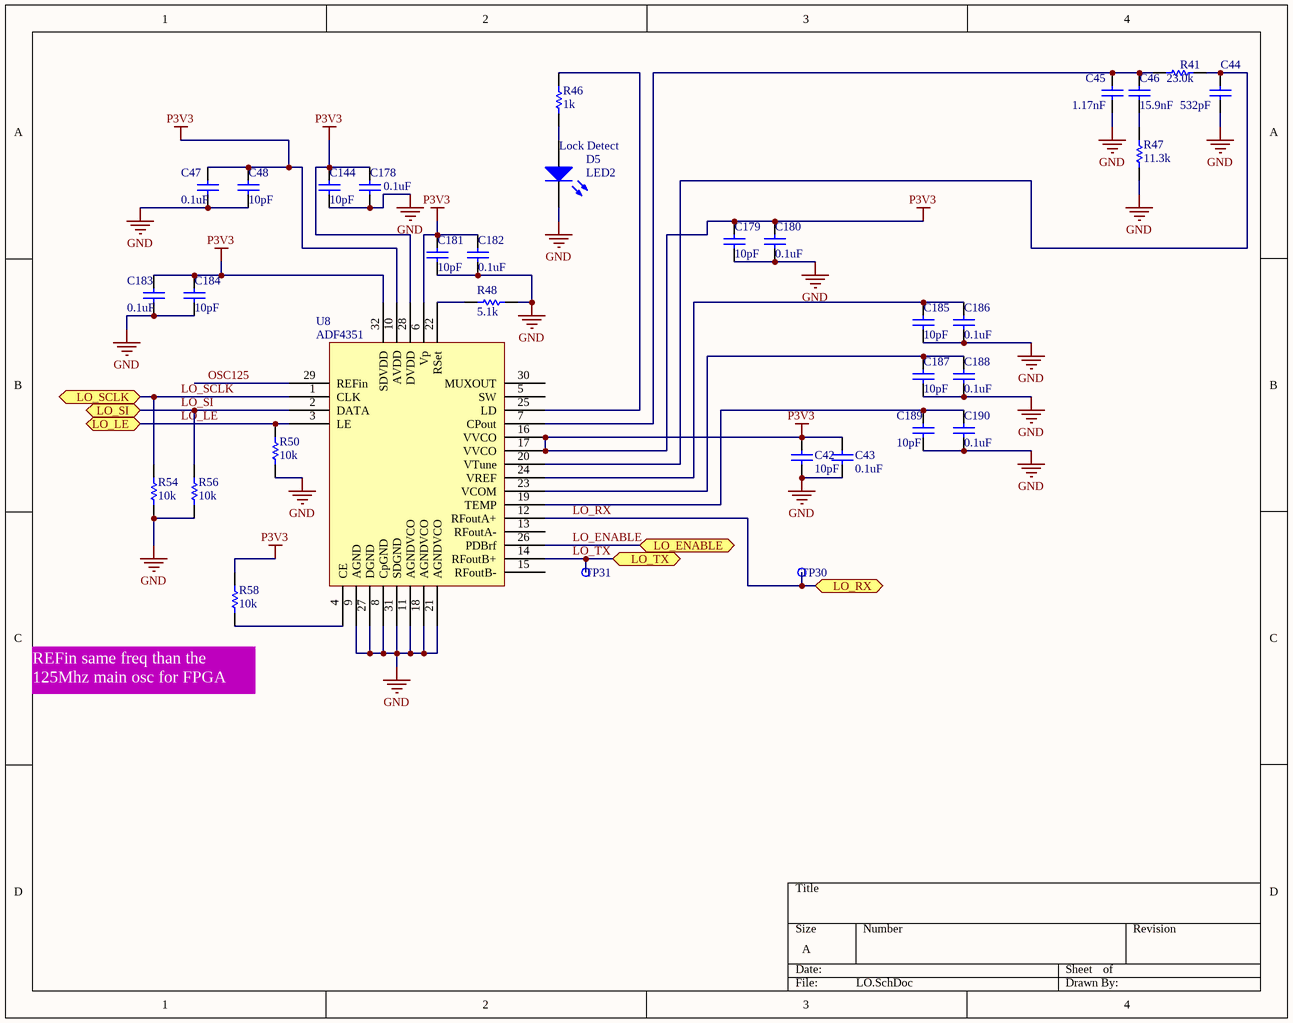
[diagram p10: LO.SchDoc]

### Parts
C42  value 10pF  [0402]  (hidden comment: Cap Semi)
C43  value 0.1uF  [0402]  (hidden comment: Cap Semi)
C44  value 532pF  [0402]  (hidden comment: Cap Semi)
C45  value 1.17nF  [0402]  (hidden comment: Cap Semi)
C46  value 15.9nF  [0402]  (hidden comment: Cap Semi)
C47  value 0.1uF  [0402]  (hidden comment: Cap Semi)
C48  value 10pF  [0402]  (hidden comment: Cap Semi)
C144  value 10pF  [0402]  (hidden comment: Cap Semi)
C178  value 0.1uF  [0402]  (hidden comment: Cap Semi)
C179  value 10pF  [0402]  (hidden comment: Cap Semi)
C180  value 0.1uF  [0402]  (hidden comment: Cap Semi)
C181  value 10pF  [0402]  (hidden comment: Cap Semi)
C182  value 0.1uF  [0402]  (hidden comment: Cap Semi)
C183  value 0.1uF  [0402]  (hidden comment: Cap Semi)
C184  value 10pF  [0402]  (hidden comment: Cap Semi)
C185  value 10pF  [0402]  (hidden comment: Cap Semi)
C186  value 0.1uF  [0402]  (hidden comment: Cap Semi)
C187  value 10pF  [0402]  (hidden comment: Cap Semi)
C188  value 0.1uF  [0402]  (hidden comment: Cap Semi)
C189  value 10pF  [0402]  (hidden comment: Cap Semi)
C190  value 0.1uF  [0402]  (hidden comment: Cap Semi)
D5  LED2  [0603]
R41  value 23.0k  [0402]  (hidden comment: Res Semi)
R46  value 1k  [0402]  (hidden comment: Res Semi)
R47  value 11.3k  [0402]  (hidden comment: Res Semi)
R48  value 5.1k  [0402]  (hidden comment: Res Semi)
R50  value 10k  [0402]  (hidden comment: Res Semi)
R54  value 10k  [0402]  (hidden comment: Res Semi)
R56  value 10k  [0402]  (hidden comment: Res Semi)
R58  value 10k  [0402]  (hidden comment: Res Semi)
TP30  LO_RX  [TPS127]  (value not drawn)
TP31  LO_TX  [TPS127]  (value not drawn)
U8  ADF4351  [ADF4350_QFN32]

### Ports
LO_ENABLE, LO_LE, LO_RX, LO_SCLK, LO_SI, LO_TX

### Nets
GND: C42.2 C43.2 C44.2 C45.2 C47.2 C48.2 C144.2 C178.2 C179.2 C180.2 C181.2 C182.2 C183.2 C184.2 C185.2 C186.2 C187.2 C188.2 C189.2 C190.2 D5.2(K) R47.2 R48.1 R50.2 R54.2 R56.2 U8.8(CpGND) U8.9(AGND) U8.11(AGNDVCO) U8.18(AGNDVCO) U8.21(AGNDVCO) U8.27(DGND) U8.31(SDGND)  [project net DXN_0]
P3V3: C42.1 C43.1 C47.1 C48.1 C144.1 C178.1 C179.1 C180.1 C181.1 C182.1 C183.1 C184.1 R58.1 U8.6(Vp) U8.10(AVDD) U8.16(VVCO) U8.17(VVCO) U8.28(DVDD) U8.32(SDVDD)  [project net VCC]
LO_ENABLE: U8.26(PDBrf) ; port LO_ENABLE
LO_LE: R50.1 U8.3(LE) ; port LO_LE
LO_RX: TP30.1 U8.12(RFoutA+) ; port LO_RX
LO_SCLK: R54.1 U8.1(CLK) ; port LO_SCLK
LO_SI: R56.1 U8.2(DATA) ; port LO_SI
LO_TX: TP31.1 U8.14(RFoutB+) ; port LO_TX
OSC125: U8.29(REFin)
NetC44_1: C44.1 R41.1 U8.20(VTune)
NetC45_1: C45.1 C46.1 R41.2 U8.7(CPout)
NetC46_2: C46.2 R47.1
NetC185_1: C185.1 C186.1 U8.24(VREF)
NetC187_1: C187.1 C188.1 U8.23(VCOM)
NetC189_1: C189.1 C190.1 U8.19(TEMP)
NetD5_1: D5.1(A) R46.2
NetR46_1: R46.1 U8.25(LD)
NetR48_2: R48.2 U8.22(RSet)
NetR58_2: R58.2 U8.4(CE)

Not connected (* = marked no-connect by the designer): U8 5(SW) 13(RFoutA-) 15(RFoutB-) 30(MUXOUT)

### Notes on the sheet
- (near D5) Lock Detect
- (near R58) REFin same freq than the 125Mhz main osc for FPGA

### Library data of the parts
C42-C48 C144 C178-C190 = Cap Semi: Capacitor (Semiconductor SIM Model); Published: 8-Jun-2000; LatestRevisionDate: 29-May-2009; LatestRevisionNote: IPC-7351 Footprint Added.; PackageReference: C1206; Publisher: Altium Limited; PackageDescription: Chip Capacitor
D5 = LED2: Typical RED, GREEN, YELLOW, AMBER GaAs LED; Published: 8-Jun-2000; LatestRevisionDate: 17-Jul-2002; LatestRevisionNote: Re-released for DXP Platform.; PackageVersion: Feb-2002; PackageReference: 3.2X1.6X1.1; Publisher: Altium Limited; PackageDescription: SM LED; 2 Flat Leads
R41 R46-R48 R50 R54 R56 R58 = Res Semi: Semiconductor Resistor; Published: 8-Jun-2000; LatestRevisionDate: 17-Jul-2002; LatestRevisionNote: Re-released for DXP Platform.; PackageReference: AXIAL-0.5; Publisher: Altium Limited; PackageDescription: Axial Device, Thru-Hole; 2 Leads; 0.5 in Pin Spacing
TP30 TP31 = SMD_PAD_1.27X1.27MM: as DFS on sheet adc; Part Number: SMD_PAD_1.27X1.27MM; Component Kind: Standard (No BOM); Component Type: Standard (No BOM); Pin Count: 1; Family: Test Point; Socket: No; SMD: Yes; Sense: No; Status: None; ComponentHeight: 0mm; HelpURL: Undefined; Author: CERN DEM JLC; CreateDate: 12.01.2008; LatestRevisionDate: 12.01.2008; PackageDescription: 1.27mm x 1.27mm PCB Copper Area (SMD Test Point)
U8 = ADF4350: VCO; PackageReference: QFN-32 ( LFCSP-32 ) ADF4351BCPZ